# Altium project EDR_ZeroGravity_FinalV5.0.PrjPcb
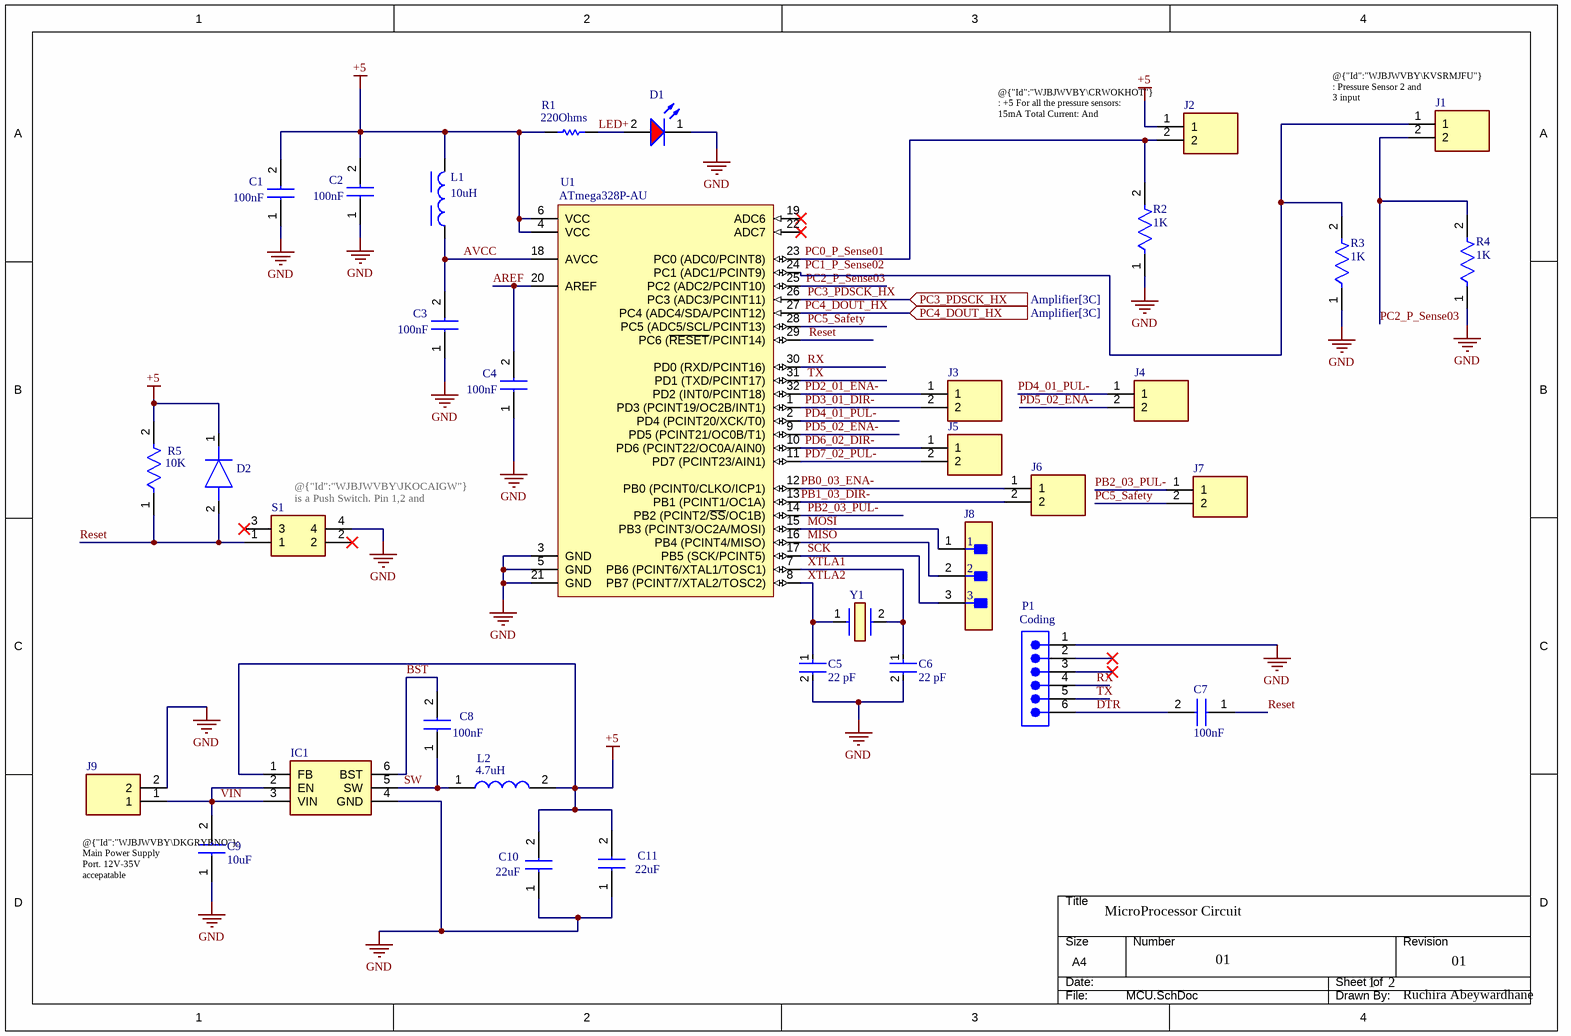
[diagram p0: MCU.SchDoc]
2 sheets, 52 parts. Net scope: flat (ports and power ports of the same name join across sheets).
Board file: ZeroGravity4Layer.PcbDoc
Sheets:
  MCU.SchDoc
  Amplifier.SchDoc

## Sheet MCU.SchDoc
size A4; SheetNumber: 1; SheetTotal: 2

### Parts
C1  value 100nF  [C0805]  (hidden comment: C0805Y104J3RACTU)
C2  value 100nF  [C0805]  (hidden comment: C0805Y104J3RACTU)
C3  value 100nF  [C0805]  (hidden comment: C0805Y104J3RACTU)
C4  value 100nF  [C0805]  (hidden comment: C0805Y104J3RACTU)
C5  Capacitance: 22 pF  [FP-C0805C-DN-MFG]  (hidden comment: C0805C220F1HACTU)
C6  Capacitance: 22 pF  [FP-C0805C-DN-MFG]  (hidden comment: C0805C220F1HACTU)
C7  value 100nF  [C0805]  (hidden comment: C0805Y104J3RACTU)
C8  value 100nF  [C0805]  (hidden comment: C0805Y104J3RACTU)
C9  value 10uF  [C0805]  (hidden comment: C0805C106K4PAC7210)
C10  value 22uF  [C0805]  (hidden comment: C0805C226K9PACTU)
C11  value 22uF  [C0805]  (hidden comment: C0805C226K9PACTU)
D1  150080RS75000  [WL-SMCW_0805_150080xx75000]  (value not drawn)
D2  CDSU4148  [DIOM179X85N]  (value not drawn)
IC1  AP63205WU-7  [AP63205WU7]  (value not drawn)
J1  1727010  [1727010]  (value not drawn)
J2  1727010  [1727010]  (value not drawn)
J3  1727010  [1727010]  (value not drawn)
J4  1727010  [1727010]  (value not drawn)
J5  1727010  [1727010]  (value not drawn)
J6  1727010  [1727010]  (value not drawn)
J7  1727010  [1727010]  (value not drawn)
J8  TMM-103-03-T-S  [FP-TMM-103-03-T-S-MFG]  (value not drawn)
J9  1727010  [1727010]  (value not drawn)
L1  value 10uH  [WE-GFH_3225]  (hidden comment: 744764910)
L2  value 4.7uH  [INDPM7366X300N]  (hidden comment: SRP7028CC-4R7M)
P1  value Coding  [SMTC-TSW-106-07-X-S]  (hidden comment: TSW-106-07-L-S)
R1  value 220Ohms  [RESC2013X60X30ML20T20]  (hidden comment: RK73H2ATTD2200F)
R2  value 1K  [FP-RK73H2A-IPC_C]  (hidden comment: RK73H2ATTD1001D)
R3  value 1K  [FP-RK73H2A-IPC_C]  (hidden comment: RK73H2ATTD1001D)
R4  value 1K  [FP-RK73H2A-IPC_C]  (hidden comment: RK73H2ATTD1001D)
R5  value 10K  [FP-RK73H2A-IPC_C]  (hidden comment: RK73H2ATTED1002F)
S1  TL3305BF160QG  [TL3305BF160QG]  (value not drawn)
U1  ATmega328P-AU  [32A_M]
Y1  ABLS-16.000MHz-16-A-4-H-T  [ABLS]  (value not drawn)

### Ports
PC3_PDSCK_HX (in, see Amplifier[3C]), PC4_DOUT_HX (in, see Amplifier[3C])

### Nets
+5: C1.2 C2.2 C10.2 C11.2 D2.1(K) IC1.1(FB) J2.1 L1.2 L2.2 R1.1 R5.2 U1.4(VCC) U1.6(VCC)
GND: C1.1 C2.1 C3.1 C4.1 C5.2 C6.2 C9.1 C10.1 C11.1 D1.1(K) IC1.4(GND) J9.2 P1.1 R2.1 R3.1 R4.1 S1.4 U1.3(GND) U1.5(GND) U1.21(GND)
AREF: C4.2 U1.20(AREF)
AVCC: C3.2 L1.1 U1.18(AVCC)
BST: C8.2 IC1.6(BST)
DTR: C7.2 P1.6
LED+: D1.2(A) R1.2
MISO: J8.2 U1.16(PB4_(PCINT4/MISO))
MOSI: J8.1 U1.15(PB3_(PCINT3/OC2A/MOSI))
PB0_03_ENA-: J6.1 U1.12(PB0_(PCINT0/CLKO/ICP1))
PB1_03_DIR-: J6.2 U1.13(PB1_(PCINT1/OC1A))
PB2_03_PUL-: J7.1 U1.14(PB2_(PCINT2/~{SS}/OC1B))
PC0_P_Sense01: J2.2 R2.2 U1.23(PC0_(ADC0/PCINT8))
PC2_P_Sense03: J1.2 R4.2 U1.25(PC2_(ADC2/PCINT10))
PC3_PDSCK_HX: U1.26(PC3_(ADC3/PCINT11)) ; port PC3_PDSCK_HX
PC4_DOUT_HX: U1.27(PC4_(ADC4/SDA/PCINT12)) ; port PC4_DOUT_HX
PC5_Safety: J7.2 U1.28(PC5_(ADC5/SCL/PCINT13))
PD2_01_ENA-: J3.1 U1.32(PD2_(INT0/PCINT18))
PD3_01_DIR-: J3.2 U1.1(PD3_(PCINT19/OC2B/INT1))
PD4_01_PUL-: J4.1 U1.2(PD4_(PCINT20/XCK/T0))
PD5_02_ENA-: J4.2 U1.9(PD5_(PCINT21/OC0B/T1))
PD6_02_DIR-: J5.1 U1.10(PD6_(PCINT22/OC0A/AIN0))
PD7_02_PUL-: J5.2 U1.11(PD7_(PCINT23/AIN1))
Reset: C7.1 D2.2(A) R5.1 S1.1 U1.29(PC6_(~{RESET}/PCINT14))
RX: P1.4 U1.30(PD0_(RXD/PCINT16))
SCK: J8.3 U1.17(PB5_(SCK/PCINT5))
SW: C8.1 IC1.5(SW) L2.1
TX: P1.5 U1.31(PD1_(TXD/PCINT17))
VIN: C9.2 IC1.2(EN) IC1.3(VIN) J9.1
XTLA1: C6.1 U1.7(PB6_(PCINT6/XTAL1/TOSC1)) Y1.2
XTLA2: C5.1 U1.8(PB7_(PCINT7/XTAL2/TOSC2)) Y1.1
NetJ1_1: J1.1 R3.2 U1.24(PC1_(ADC1/PCINT9))

Not connected (* = marked no-connect by the designer): P1 2* 3*; S1 2* 3*; U1 19(ADC6)* 22(ADC7)*

### Notes on the sheet
- Type @ to refer to a designator or a net
- (near J1) @{"Id":"WJBJWVBY\KVSRMJFU"} : Pressure Sensor 2 and 3 input
- @{"Id":"WJBJWVBY\CRWOKHOT"} : +5 For all the pressure sensors: 15mA Total Current: And Pressure Sensor 01 Input
- (near S1) @{"Id":"WJBJWVBY\JKOCAIGW"} is a Push Switch. Pin 1,2 and 3,4 are  internally connected
- @{"Id":"WJBJWVBY\DKGRYBNO"}: Main Power Supply Port. 12V-35V accepatable
- MicroProcessor Circuit
- 01
- 1
- 2
- Ruchira Abeywardhane
- Labels drawn without touching a wire or pin: PC1_P_Sense02
- THIS DOCUMENT AND THE DATA DISCLOSED HEREIN OR
- HEREWITH IS THE PROPERTY OF ALTIUM LIMITED AND MAY
- DWG NO:
- REVISION
- REV:
- DESCRIPTION
- DATE
- APPROVED
- BE FREELY DISTRIBUTED IN WHOLE. NO RIGHTS ARE
- RESERVED OR EXPRESS OR IMPLIED WARANTEE GIVEN.
- ENG:
- APPROVALS
- PROJECT
- DSN:
- CHK:
- REFERENCE DOCUMENTS
- PROJECT REVISION:
- TITLE
- DOCUMENT REVISION:
- DESIGN ITEM:
- BOM:
- FAB DWG:
- PCB DWG:
- ASSY DWG:
- SCALE:
- A3
- SIZE
- CAGE CODE
- FILE NAME
- DWG NO.
- SHEET
- OF
- REV

### Library data of the parts
C1-C4 C7 C8 = C0805Y104J3RACTU: Capacitor; Manufacturer_Name: KEMET; Datasheet Link: https://content.kemet.com/datasheets/KEM_C1015_X7R_FF-CAP_SMD.pdf; Height: 1.1mm; Manufacturer_Part_Number: C0805Y104J3RACTU
C5 C6 = CMP-03020-009085-1: C0805 22 pF X8R 30ppm/°C 1.00% 100 V; Manufacturer: KEMET; Value: 22 pF; Material: Ceramic; Voltage Rating: 100 V; Tolerance: 0.01; Temperature: -55°C to +125°C; ComponentLink2Description: Datasheet; Ipc Land Pattern Name: CAPC200125X78; Temperature Characteristic: X8R; ComponentLink2URL: https://content.kemet.com/datasheets/KEM_C1003_C0G_SMD.pdf; Category: Cap; Device Class L1: Passive Components; RoHS: TRUE; Temperature Range Low: -55°C; Device Class L3: Ceramic Capacitors; Height: 0.88mm; Device Class L2: Capacitors; Octopart: https://octopart.com/c0805c220f1hactu-kemet-88726806; Manufacturer Part Number: C0805C220F1HACTU; Package: C0805C-DN; Temperature Range High: +125°C; Temperature Coefficient: 30ppm/°C; Automotive: No; Lead Free: Yes
C9 = C0805C106K4PAC7210: Capacitor; Manufacturer_Name: KEMET; Datasheet Link: https://content.kemet.com/datasheets/KEM_C1006_X5R_SMD.pdf; Height: 1.1mm; Manufacturer_Part_Number: C0805C106K4PAC7210; Mouser Part Number: 80-C0805C106K4P7210; Mouser Price/Stock: https://www.mouser.co.uk/ProductDetail/KEMET/C0805C106K4PAC7210?qs=zDkSFN9STR9jrJZBgSwCDA%3D%3D; Arrow Part Number: C0805C106K4PAC7210; Arrow Price/Stock: https://www.arrow.com/en/products/c0805c106k4pac7210/kemet-corporation
C10 C11 = C0805C226K9PACTU: Capacitor; Manufacturer_Name: KEMET; Datasheet Link: https://content.kemet.com/datasheets/KEM_C1006_X5R_SMD.pdf; Height: 1.1mm; Manufacturer_Part_Number: C0805C226K9PACTU; Mouser Part Number: 80-C0805C226K9PACTU; Mouser Price/Stock: https://www.mouser.co.uk/ProductDetail/KEMET/C0805C226K9PACTU?qs=CmJlwSR1kv6i2XEByn7wWw%3D%3D; Arrow Part Number: C0805C226K9PACTU; Arrow Price/Stock: https://www.arrow.com/en/products/c0805c226k9pactu/kemet-corporation
D1 = CMP-1426-00011-2: NexarPartId: 29717781; Peak Wavelength: 630nm; Wavelength: 625nm; Viewing Angle: 140°; Test Current: 20mA; Forward Voltage: 2V; Forward Current: 100mA; Lens Style: Clear, Rectangular; Color: Red; Luminous Intensity: 150mcd; Max Reverse Voltage (DC): 5V; Length: 2mm; Case Code (Imperial): 0805; RoHS: Compliant; Max Operating Temperature: 85°C; Height: 700µm; Packaging: Tape and Reel; Case/Package: 0805; REACH SVHC: Unknown; Dominant Wavelength: 625nm; Min Operating Temperature: -40°C; Case Code (Metric): 2012; Mount: Surface Mount; Width: 1.25mm
D2 = CDSU4148: Diode; Manufacturer_Name: Comchip Technology; Datasheet Link: https://datasheet.datasheetarchive.com/originals/distributors/Datasheets-7/DSA-139250.pdf; Height: 0.85mm; Manufacturer_Part_Number: CDSU4148; Mouser Part Number: 750-CDSU4148; Mouser Price/Stock: https://www.mouser.co.uk/ProductDetail/Comchip-Technology/CDSU4148?qs=tw%252BuQ%2FB6PO1A4Pq3N4jPEA%3D%3D; Arrow Part Number: CDSU4148; Arrow Price/Stock: https://www.arrow.com/en/products/cdsu4148/comchip-technology?region=nac
IC1 = AP63205WU-7: Integrated Circuit; Manufacturer_Name: Diodes Incorporated; Datasheet Link: https://www.diodes.com//assets/Datasheets/AP63200-AP63201-AP63203-AP63205.pdf; Height: 1mm; Manufacturer_Part_Number: AP63205WU-7; Mouser Part Number: 621-AP63205WU-7; Mouser Price/Stock: https://www.mouser.co.uk/ProductDetail/Diodes-Incorporated/AP63205WU-7?qs=u16ybLDytRZtkj8PzdWCOw%3D%3D; Arrow Part Number: AP63205WU-7; Arrow Price/Stock: https://www.arrow.com/en/products/ap63205wu-7/diodes-incorporated?region=europe
J1-J7 J9 = 1727010: Connector; Manufacturer_Name: Phoenix Contact; Datasheet Link: https://datasheet.datasheetarchive.com/originals/distributors/SFDatasheet-2/sf-00050638.pdf; Height: 8.65mm; Manufacturer_Part_Number: 1727010; Mouser Part Number: 651-1727010; Mouser Price/Stock: https://www.mouser.co.uk/ProductDetail/Phoenix-Contact/1727010?qs=JcjeNNoqGSMjtHhQoBJ7UA%3D%3D; Arrow Part Number: 1727010; Arrow Price/Stock: https://www.arrow.com/en/products/1727010/phoenix-contact?region=nac
J8 = CMP-02766-001695-1: CONN HEADER VERT 3POS 2MM; Gender: Male; Number of Positions: 3; Max Current Rating: 3.9A; Max Voltage Rating (AC): 500V; Packaging: Bulk; RoHS Compliant: Yes; Mount: Through Hole; Length: 6mm; Contact Type: Male Pin; Package Quantity: 1; Depth: 1.97mm; Contact Material: Bronze; Insulation Material: Polymer; Series: TMM; Contact Plating: Tin; Fastening Type: Pull; Housing Color: Black; Pitch: 2mm; Termination: Solder; Contact Mating Length: 0.157inch; Min Operating Temperature: -55°C; REACH SVHC: No SVHC; Orientation: Straight; Number of Rows: 1; Color: Black; Insulation Color: Black; Connector Type: Header; Radiation Hardening: No; Number of Contacts: 3; Lead Free: Lead Free; Contact Finish - Mating: TIN; Max Operating Temperature: 105°C; Housing Material: Polymer; Contact Shape: Square
L1 = CMP-03913-61645378-1: 744764910 General Purpose Inductor, 10uH, 10%, 1 Element, SMD, 1210; Current Rating: 500mA; Shielding: Unshielded; Inductance: 10µH; Self Resonant Frequency: 40MHz; DC Resistance (DCR): 995mΩ; Test Frequency: 1.47MHz; Core Material: Ferrite; RoHS: Compliant; Ambient Temperature Range High: 85°C; Ambient Temperature Range Low: -40°C; Width: 2.5mm; Min Operating Temperature: -40°C; Case/Package: Nonstandard; Length: 3.2mm; REACH SVHC: Unknown; Inductance Tolerance: 10%; Mount: Surface Mount; Height: 2.2mm; Packaging: Tape & Reel (TR); Max DC Current: 500mA; NexarPartId: 61645378; Height - Seated (Max): 2.3876mm; Max Operating Temperature: 125°C; Tolerance: 10%
L2 = SRP7028CC-4R7M: Inductor; Manufacturer_Name: Bourns; Datasheet Link: https://www.bourns.com/docs/Product-Datasheets/SRP7028CC.pdf; Height: 3mm; Manufacturer_Part_Number: SRP7028CC-4R7M; Mouser Part Number: 652-SRP7028CC-4R7M; Mouser Price/Stock: https://www.mouser.co.uk/ProductDetail/Bourns/SRP7028CC-4R7M?qs=1Kr7Jg1SGW%252BnpjZpZxrorQ%3D%3D
P1 = CMP-1024-00386-1: 0.025" SQ Post Header, Through-hole, Vertical, -55 to 125 degC, 2.54 mm Pitch, 6-Pin, Male, RoHS; Manufacturer: Samtec; Pitch: 2.54 mm; RoHS: True; PartNumber: TSW-106-07-L-S; Orientation: Vertical; PackageReference: TSW-106-07-X-S; PackageDescription: .025[0.64] SQ. Post Terminal Strip Assembly; DatasheetVersion: F-214; ComponentLink3Description: Package Specification; Mounting Technology: Through-hole; ComponentLink2Description: Datasheet; PackageVersion: DM, 8/1988; ComponentLink3URL: http://www.samtec.com/documents/webfiles/cpdf/TSW-XXX-XX-XXX-X-XX-XXX-MKT.pdf; Temperature Range: -55 to 125 degC; ComponentLink2URL: http://www.samtec.com/documents/webfiles/pdf/TSW_TH.PDF; ComponentLink1Description: Manufacturer URL; ComponentLink1URL: http://www.samtec.com
R1 = CMP-2001-02206-1: Manufacturer: KOA Speer; Part Number: RK73H2ATTD2200F
R2-R4 = CMP-04015-089471-1: 1kΩ ±0.5% 0.25W Chip Resistor 0805 Thick Film AEC-Q200 Qualified; RoHS Compliant: Yes
R5 = CMP-04015-088604-1: 10kΩ ±1% 0.25W Chip Resistor 0805 Thick Film AEC-Q200 Qualified; Resistance: 10kR; Voltage Rating: 150V; Temperature Coefficient: 100ppm/°C; Power Rating: 125mW; Packaging: Tape and Reel; Case Code (Imperial): 0805; Min Operating Temperature: -55°C; Height: 0.5mm; Construction: Rectangular; Tolerance: 1%; Termination: SMD/SMT; Case Code (Metric): 2012; Max Operating Temperature: 155°C; Package Quantity: 10000; RoHS Compliant: Yes; Lead Free: Lead Free; Series: RK73H; Depth: 1.25mm; Case/Package: 0805; Length: 2mm; Width: 1.25mm; Resistor Type: Thick Film; Military Standard: Not
S1 = TL3305BF160QG: Switch; Manufacturer_Name: E-Switch; Datasheet Link: https://configured-product-images.s3.amazonaws.com/2D/specs/TL3305BF160QG.pdf; Height: 5.25mm; Manufacturer_Part_Number: TL3305BF160QG; Mouser Part Number: 612-TL3305BF160QG; Mouser Price/Stock: https://www.mouser.co.uk/ProductDetail/E-Switch/TL3305BF160QG?qs=UrFqKgNWc7SMzrRgAbHJ9w%3D%3D
U1 = CMP-0095-00269-2: 8-bit AVR Microcontroller, 32KB Flash, 1KB EEPROM, 2KB SRAM, 32-pin TQFP, Industrial Grade (-40°C to 85°C); PackageDescription: 32-Lead, 7x7x1.0 mm Body, 0.8mm Lead Pitch, Thin Profile Plastic Quad Flat Package (TQFP); DatasheetVersion: revD, May-2011; RevisionNote: DatasheetVersion & PackageVersion updated. URLs added.; ComponentLink1URL: http://www.atmel.com/; ComponentLink2Description: ATmega48A/48PA/88A/88PA/168A/168PA/328/328P Datasheet; Code_JEDEC: MS-026-ABA; ComponentLink1Description: Manufacturer URL; PackageReference: 32A; ComponentLink3Description: ATmega48A/48PA/88A/88PA/168A/168PA/328/328P Summary; ComponentLink2URL: http://www.atmel.com/dyn/resources/prod_documents/doc8271.pdf; PackageVersion: revC, Oct-2010; ComponentLink3URL: http://www.atmel.com/dyn/resources/prod_documents/8271S.pdf
Y1 = ABLS-16.000MHz-16-A-4-H-T: Crystal or Oscillator; Manufacturer_Name: ABRACON; Datasheet Link: https://abracon.com/Resonators/abls.pdf; Manufacturer_Part_Number: ABLS-16.000MHz-16-A-4-H-T; Mouser Part Number: 815-LS16000MHZ16A4HT; Mouser Price/Stock: https://www.mouser.co.uk/ProductDetail/ABRACON/ABLS-16.000MHZ-16-A-4-H-T?qs=vLWxofP3U2z6hhU1at4Vrw%3D%3D; Arrow Part Number: ABLS-16.000MHZ-16-A-4-H-T; Arrow Price/Stock: https://www.arrow.com/en/products/abls-16.000mhz-16-a-4-h-t/abracon

## Sheet Amplifier.SchDoc
size A4; SheetNumber: 2; SheetTotal: 2
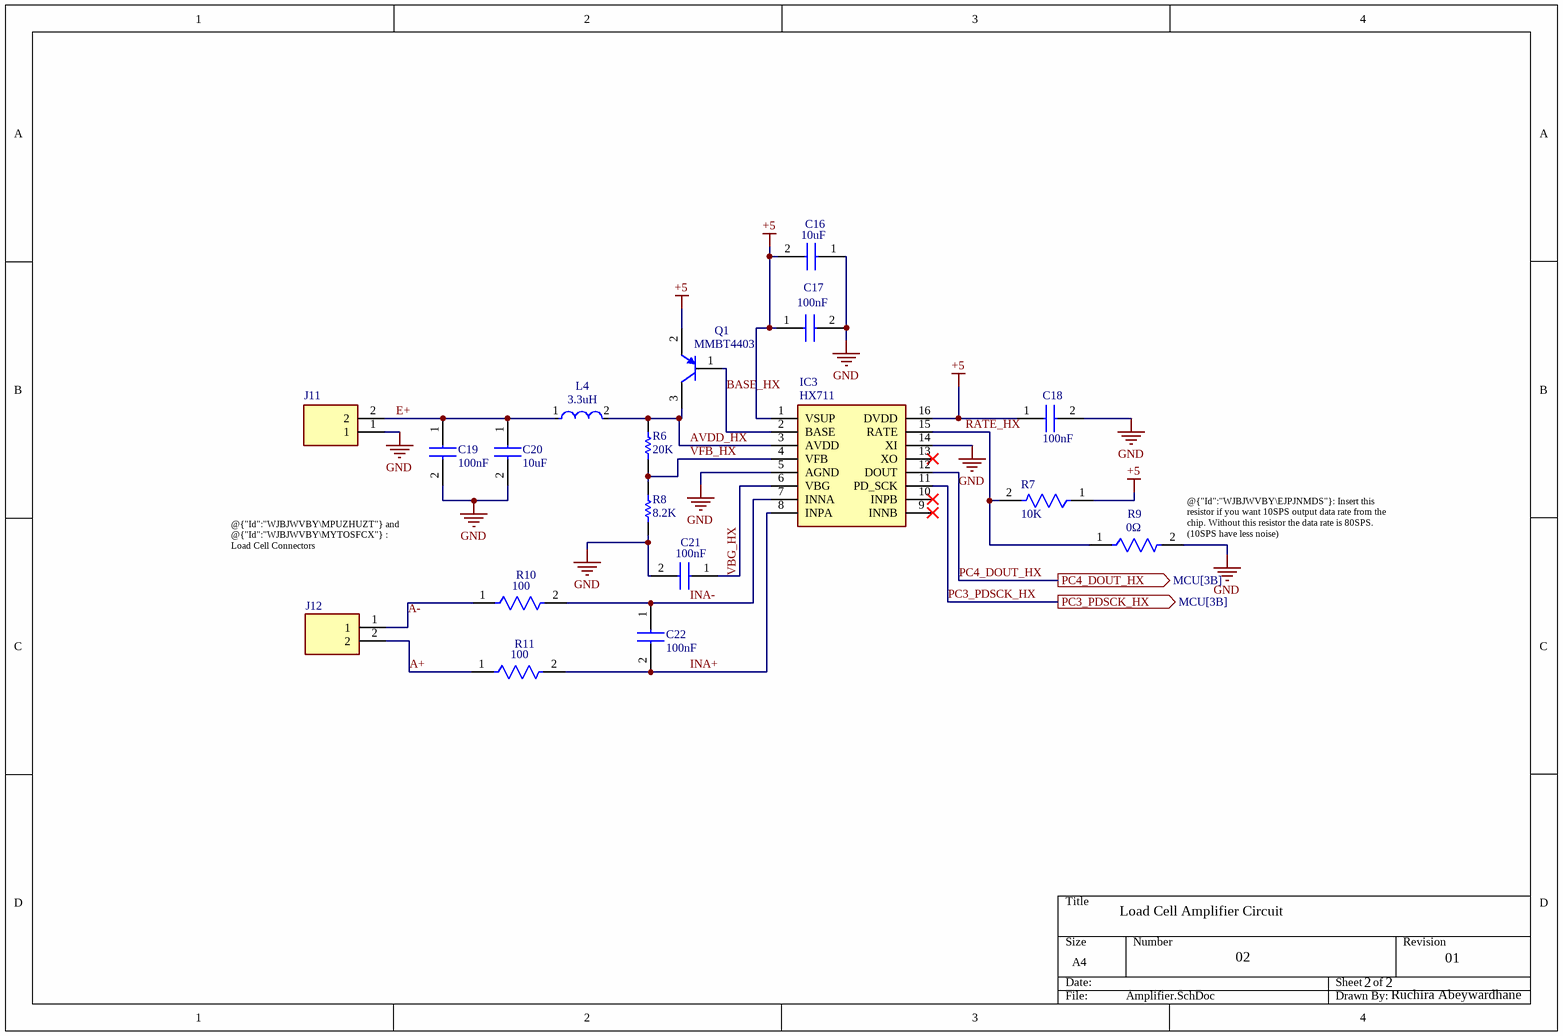
[diagram p1: Amplifier.SchDoc]

### Parts
C16  value 10uF  [C0805]  (hidden comment: C0805C106K4PAC7210)
C17  value 100nF  [C0805]  (hidden comment: C0805Y104J3RACTU)
C18  value 100nF  [C0805]  (hidden comment: C0805Y104J3RACTU)
C19  value 100nF  [C0805]  (hidden comment: C0805Y104J3RACTU)
C20  value 10uF  [C0805]  (hidden comment: C0805C106K4PAC7210)
C21  value 100nF  [C0805]  (hidden comment: C0805Y104J3RACTU)
C22  value 100nF  [C0805]  (hidden comment: C0805Y104J3RACTU)
IC3  HX711  [SOIC127P600X160-16N]
J11  1727010  [1727010]  (value not drawn)
J12  1727010  [1727010]  (value not drawn)
L4  value 3.3uH  [FP-MLZ2012-0_85-IPC_C]  (hidden comment: MLZ2012A3R3WTD25)
Q1  Model: MMBT4403  [ONSC-SOT-723-3-631AA-01_C_V]  (hidden comment: MMBT4403M3T5G)
R6  value 20K  [RESC2013X60X30LL20T20]  (hidden comment: RK73H2ATTD2002F)
R7  value 10K  [FP-RK73H2A-IPC_C]  (hidden comment: RK73H2ATTED1002F)
R8  value 8.2K  [RESC2013X60X30NL20T20]  (hidden comment: RK73H2ATTD8201F)
R9  Resistance: 0Ω  [FP-RCC0805-e3-MFG]  (hidden comment: RCC08050000Z0EA)
R10  value 100  [FP-RK73H2A-IPC_A]  (hidden comment: RK73H2ATTED1000F)
R11  value 100  [FP-RK73H2A-IPC_A]  (hidden comment: RK73H2ATTED1000F)

### Ports
PC3_PDSCK_HX (out, see MCU[3B]), PC4_DOUT_HX (out, see MCU[3B])

### Nets
+5: C16.2 C17.1 C18.1 IC3.1(VSUP) IC3.16(DVDD) Q1.2(E) R7.1
GND: C16.1 C17.2 C18.2 C19.2 C20.2 C21.2 IC3.5(AGND) IC3.14(XI) J11.1 R8.1 R9.2
A+: J12.2 R11.1
A-: J12.1 R10.1
AVDD_HX: IC3.3(AVDD) L4.2 Q1.3(C) R6.2
BASE_HX: IC3.2(BASE) Q1.1(B)
E+: C19.1 C20.1 J11.2 L4.1
INA+: C22.2 IC3.8(INPA) R11.2
INA-: C22.1 IC3.7(INNA) R10.2
PC3_PDSCK_HX: IC3.11(PD_SCK) ; port PC3_PDSCK_HX
PC4_DOUT_HX: IC3.12(DOUT) ; port PC4_DOUT_HX
RATE_HX: IC3.15(RATE) R7.2 R9.1
VBG_HX: C21.1 IC3.6(VBG)
VFB_HX: IC3.4(VFB) R6.1 R8.2

Not connected (* = marked no-connect by the designer): IC3 9(INNB)* 10(INPB)* 13(XO)*

### Notes on the sheet
- @{"Id":"WJBJWVBY\MPUZHUZT"} and @{"Id":"WJBJWVBY\MYTOSFCX"} : Load Cell Connectors
- (near R9) @{"Id":"WJBJWVBY\EJPJNMDS"}: Insert this resistor if you want 10SPS output data rate from the chip. Without this resistor the data rate is 80SPS. (10SPS have less noise)
- Load Cell Amplifier Circuit
- 02
- 2
- 01
- Ruchira Abeywardhane

### Library data of the parts
C16 C20 = C0805C106K4PAC7210: Capacitor; Manufacturer_Name: KEMET; Datasheet Link: https://content.kemet.com/datasheets/KEM_C1006_X5R_SMD.pdf; Height: 1.1mm; Manufacturer_Part_Number: C0805C106K4PAC7210; Mouser Part Number: 80-C0805C106K4P7210; Mouser Price/Stock: https://www.mouser.co.uk/ProductDetail/KEMET/C0805C106K4PAC7210?qs=zDkSFN9STR9jrJZBgSwCDA%3D%3D; Arrow Part Number: C0805C106K4PAC7210; Arrow Price/Stock: https://www.arrow.com/en/products/c0805c106k4pac7210/kemet-corporation
C17-C19 C21 C22 = C0805Y104J3RACTU: Capacitor; Manufacturer_Name: KEMET; Datasheet Link: https://content.kemet.com/datasheets/KEM_C1015_X7R_FF-CAP_SMD.pdf; Height: 1.1mm; Manufacturer_Part_Number: C0805Y104J3RACTU
IC3 = HX711: Integrated Circuit; Manufacturer_Name: AVIA; Datasheet Link: https://cdn.sparkfun.com/datasheets/Sensors/ForceFlex/hx711_english.pdf; Height: 1.6mm; Manufacturer_Part_Number: HX711
J11 J12 = 1727010: as J1 on sheet MCU; Datasheet Link: https://datasheet.datasheetarchive.com/originals/distributors/SFDatasheet-2/sf-00050638.pdf; Height: 8.65mm; Manufacturer_Part_Number: 1727010; Mouser Part Number: 651-1727010; Mouser Price/Stock: https://www.mouser.co.uk/ProductDetail/Phoenix-Contact/1727010?qs=JcjeNNoqGSMjtHhQoBJ7UA%3D%3D; Arrow Part Number: 1727010; Arrow Price/Stock: https://www.arrow.com/en/products/1727010/phoenix-contact?region=nac
L4 = CMP-08253-000097-1: Shielded Multilayer Inductor 3.3uH ±20% 450mA 442mΩ AEC-Q200 SMD 0805; Saturation Current: 200mA; Core Material: Ferrite; Test Frequency: 10MHz; DC Resistance (DCR): 442mR; Resistance: 0.442R; Height: 0.85mm; Tolerance: 20%; RoHS Compliant: Yes; Min Operating Temperature: -55°C; Inductance: 3.3uH; Termination: SMD/SMT; Shielding: Shielded; Case Code (Metric): 2012; Max Operating Temperature: 125°C; Height - Seated (Max): 0.041inch; Ratings: AEC-Q200; Case/Package: 0805; Mount: Surface Mount; Length: 0.079inch; Packaging: Tape and Reel; Current Rating: 450mA; Package Quantity: 4000; Case Code (Imperial): 0805; Max DC Current: 450mA; Weight: 0.000194oz; Width: 0.049inch
Q1 = CMP-1048-00929-1: PNP Switching Transistor, 3-Pin SOT-723, Pb-Free, Tape and Reel; Manufacturer: On Semiconductor; IC Continuous (A): -0.6; fT Min (MHz): 200; ComponentLink1URL: http://www.onsemi.com/; PartNumber: MMBT4403M3T5G; ComponentLink3Description: Package Specification; PackageVersion: Rev. C, 08/2006; RoHS: TRUE; ComponentLink2Description: Datasheet; DatasheetVersion: Rev. 0; Mounting Technology: Surface Mount; Polarity: PNP; ComponentLink1Description: Manufacturer URL; PackageReference: SOT-723-3-631AA-01_C; Packing: Tape and Reel; PackageDescription: 3-Pin SOT223, Body 0.8 x 1.2 mm, Pitch 0.4 mm; ComponentLink3URL: http://www.onsemi.cn/pub_link/Collateral/BAT54M3-D.PDF; ComponentLink2URL: http://www.onsemi.com/pub_link/Collateral/MMBT4403M3-D.PDF
R6 = CMP-2001-02185-1: Manufacturer: KOA Speer; Part Number: RK73H2ATTD2002F
R7 = CMP-04015-088604-1: as R5 on sheet MCU; Packaging: Tape and Reel; Case Code (Imperial): 0805; Min Operating Temperature: -55°C; Height: 0.5mm; Construction: Rectangular; Tolerance: 1%; Termination: SMD/SMT; Case Code (Metric): 2012; Max Operating Temperature: 155°C; Package Quantity: 10000; RoHS Compliant: Yes; Lead Free: Lead Free; Series: RK73H; Depth: 1.25mm; Case/Package: 0805; Length: 2mm; Width: 1.25mm; Resistor Type: Thick Film; Military Standard: Not
R8 = CMP-2001-02517-1: Manufacturer: KOA Speer; Part Number: RK73H2ATTD8201F
R9 = CMP-00030-108211984-1: RCC08050000Z0EA Res Thick Film 0805 0 Ohm Conformal Coated Pad SMD Automotive AEC-Q200 T/R; Voltage Rating: 200V; Power Rating: 250mW; Composition: Thick Film; Max Operating Temperature: 155°C; Case/Package: 0805; Height: 500µm; NexarPartId: 108211984; Min Operating Temperature: -55°C
R10 R11 = CMP-04015-093159-1: 100Ω ±1% 0.25W Chip Resistor 0805 Thick Film AEC-Q200 Qualified; Voltage Rating: 150V; Temperature Coefficient: 100ppm/°C; Power Rating: 125mW; Resistance: 100R; Series: RK73H; Resistor Type: Thick Film; Military Standard: Not; Construction: Rectangular; Termination: SMD/SMT; Tolerance: 1%; Max Operating Temperature: 155°C; Packaging: Tape and Reel; Min Operating Temperature: -55°C; Length: 2mm; Case/Package: 0805; Case Code (Imperial): 0805; Case Code (Metric): 2012; Depth: 1.25mm; Lead Free: Lead Free

## Nets that join several sheets
+5: MCU (13 pins), Amplifier (7 pins)
GND: MCU (20 pins), Amplifier (11 pins)
PC3_PDSCK_HX: MCU (U1.26), Amplifier (IC3.11)
PC4_DOUT_HX: MCU (U1.27), Amplifier (IC3.12)